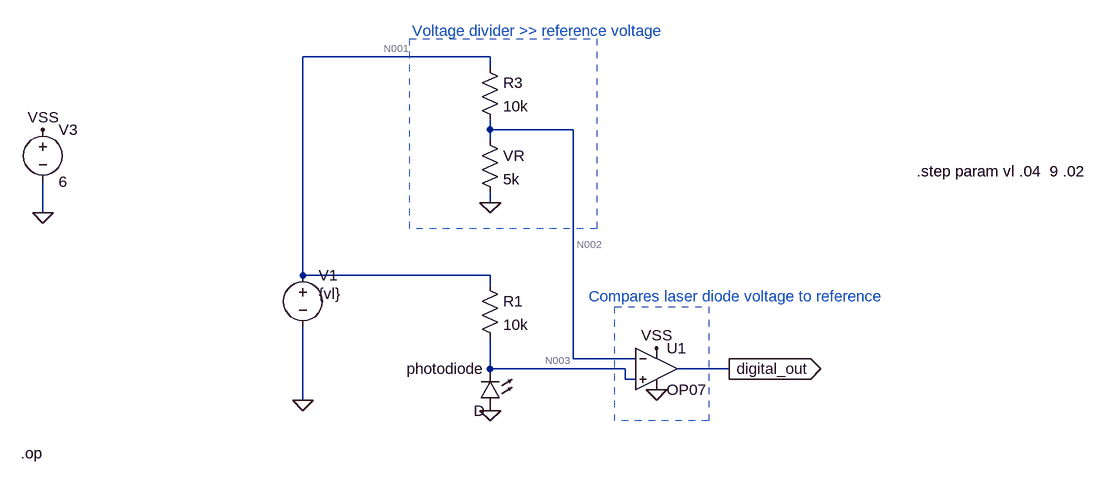
[diagram p0: schematic laserCircuit.asc]
laserCircuit.asc, the LTspice schematic file:
Version 4
SHEET 1 1196 680
WIRE 208 -176 -80 -176
WIRE 208 -160 208 -176
WIRE 208 -64 208 -80
WIRE 336 -64 208 -64
WIRE 208 -48 208 -64
WIRE 208 48 208 32
WIRE -480 64 -480 16
WIRE -80 160 -80 -176
WIRE 208 160 -80 160
WIRE 208 176 208 160
WIRE 336 288 336 -64
WIRE 432 288 336 288
WIRE 208 304 208 256
WIRE 416 304 208 304
WIRE 576 304 496 304
WIRE 416 320 416 304
WIRE 432 320 416 320
WIRE -80 352 -80 240
FLAG -80 352 0
FLAG 208 368 0
FLAG -480 64 0
FLAG -480 -64 VSS
FLAG 208 48 0
FLAG 576 304 digital_out
IOPIN 576 304 Out
FLAG 464 272 VSS
FLAG 464 336 0
DATAFLAG 16 160 ""
SYMBOL Voltage -80 144 R0
WINDOW 3 24 44 Left 2
WINDOW 123 0 0 Left 0
WINDOW 39 0 0 Left 0
SYMATTR InstName V1
SYMATTR Value {vl}
SYMBOL LED 224 368 R180
WINDOW 0 24 64 Left 2
WINDOW 3 24 0 Left 2
SYMATTR InstName photodiode
SYMBOL Res 192 160 R0
SYMATTR InstName R1
SYMATTR Value 10k
SYMBOL Voltage -480 -80 R0
WINDOW 123 0 0 Left 0
WINDOW 39 0 0 Left 0
SYMATTR InstName V3
SYMATTR Value 6
SYMBOL Res 192 -176 R0
SYMATTR InstName R3
SYMATTR Value 10k
SYMBOL res 192 -64 R0
SYMATTR InstName VR
SYMATTR Value 5k
SYMBOL OpAmps\\OP07 464 240 R0
SYMATTR InstName U1
TEXT 88 -216 Left 2 ;Voltage divider >> reference voltage
TEXT 864 0 Left 2 !.step param vl .04  9 .02
TEXT -514 434 Left 2 !.op
TEXT 360 192 Left 2 ;Compares laser diode voltage to reference
RECTANGLE Normal 84 -204 372 88 2
RECTANGLE Normal 544 384 400 208 2

The netlist it stands for:
* laserCircuit.asc
V1 N001 0 {vl}
D§photodiode 0 N003 D
R1 N001 N003 10k
V3 VSS 0 6
R3 N001 N002 10k
R§VR N002 0 5k
XU1 N003 N002 VSS 0 digital_out LT1001  ; OP07, pins In+ In- V+ V- OUT
.model D D
.lib standard.dio
* Voltage divider >> reference voltage
.step param vl .04  9 .02
.op
* Compares laser diode voltage to reference
.lib LTC.lib
.backanno
.end

* Results of the author's LTspice run, read from the files saved beside the schematic
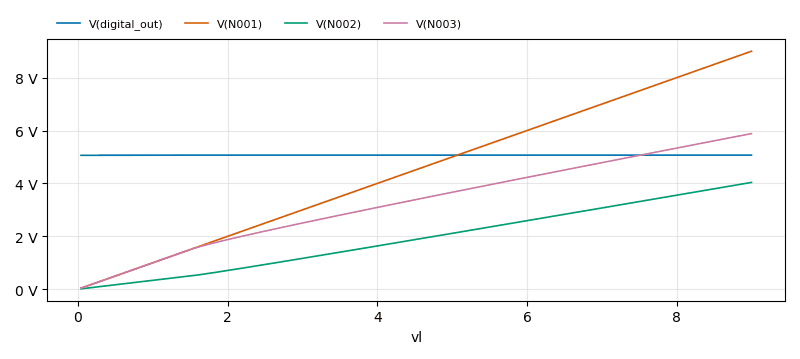
[diagram p1: Operating Point of laserCircuit.asc, plotted from the saved traces]
* Operating Point, 1 run:
*   V(digital_out): 5.063 V at vl=40 m, 5.07 V at vl=9 , min 5.063 V, max 5.07 V
*   V(N001): 40 mV at vl=40 m, 9 V at vl=9 , min 40 mV, max 9 V
*   V(N002): 13.33 mV at vl=40 m, 4.038 V at vl=9 , min 13.33 mV, max 4.038 V
*   V(N003): 40 mV at vl=40 m, 5.885 V at vl=9 , min 40 mV, max 5.885 V
* From the log:
*   Semiconductor Device Operating Points:
*                           --- Diodes ---
*   Name:    d:u1:4      d:u1:1    d§photodiode
*   Model:    u1:di       u1:x          d
*   Id:     -2.67e-11   -2.27e-07   -4.79e-14
*   Vd:     -2.67e-02   -8.41e-01   -4.00e-02
*   Req:     1.00e-09    1.00e-04    9.24e+11
*   CAP:     0.00e+00    0.00e+00    0.00e+00
*                           --- VDMOSFET Transistors ---
*   Name:        m:u1:2      m:u1:1
*   Model:        u1:p        u1:n
*   Id:         -2.25e-03    2.25e-03
*   Vgs:        -7.56e-06   -7.56e-06
*   Vds:        -5.06e+00    9.37e-01
*   Vth:         3.00e-01   -3.00e-01
*   Gm:          1.50e-02    1.50e-02
*   Gds:         0.00e+00    0.00e+00
*   Cgs:         0.00e+00    0.00e+00
*   Cgd:         0.00e+00    0.00e+00
*   Cbody:       0.00e+00    0.00e+00